# Altium schematic sheet as14120_adc.SchDoc
size A3; PageSetup: Record=PageOptions|CenterHorizontal=True|CenterVertical=True|PrintScale=1.11|XCorrection=1.00|YCorrection=1.00|PrintKind=0|BorderSize=5000000|LeftOffset=0|BottomOffset=0|Orientation=2|PaperLength=1000|PaperWidth=1000|Scale=100|PaperSource=7|PrintQuality=-4|MediaType=1|DitherType=10|PaperKind=A4 (210 x 297 мм)|PrintScaleMode=1
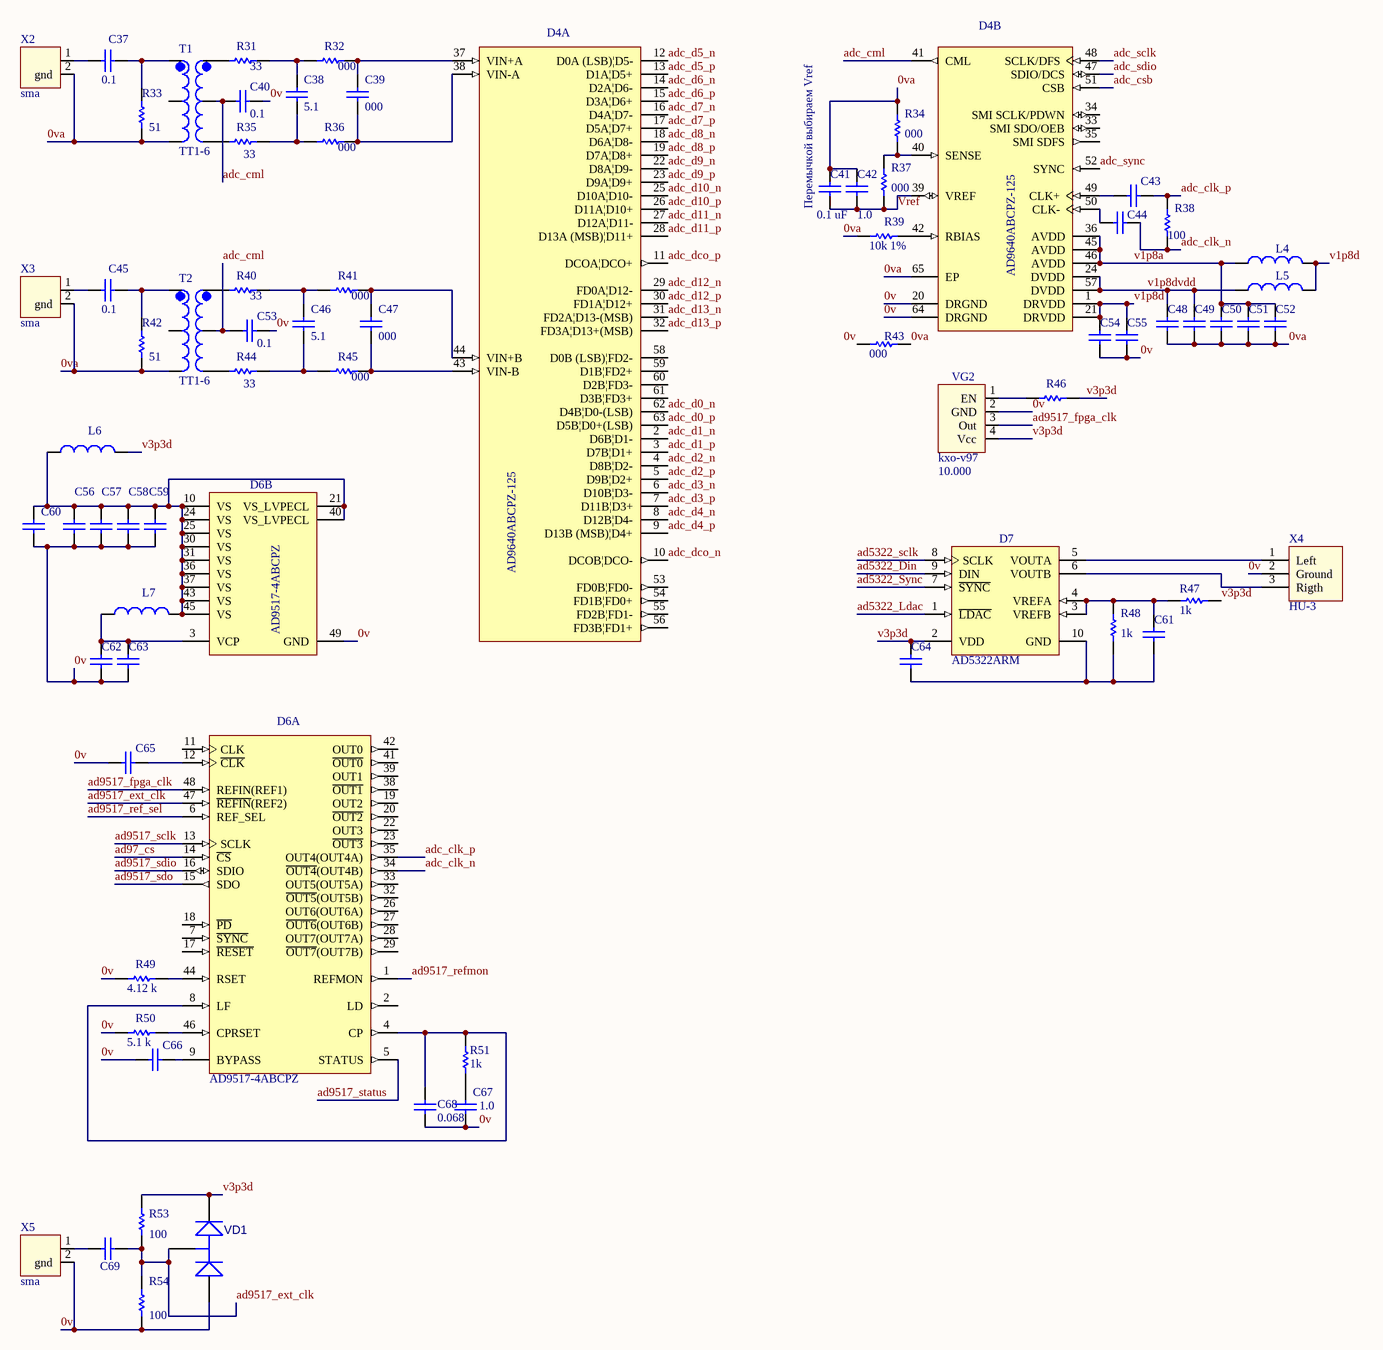
[diagram p0: as14120_adc.SchDoc]

## Parts
C37  value 0.1  [CAPC0402(1005)60_M]  (hidden comment: CAP 1uF 10V 0402(1005))
C38  value 5.1  [CAPC0805(2012)100_N]  (hidden comment: CAP_0805)
C39  value 000  [CAPC0805(2012)100_N]  (hidden comment: CAP_0805)
C40  value 0.1  [CAPC0402(1005)60_M]  (hidden comment: CAP 1uF 10V 0402(1005))
C41  value 0.1 uF  [CAPC0402(1005)60_M]  (hidden comment: CAP 1uF 10V 0402(1005))
C42  value 1.0  [CAPC0402(1005)60_M]  (hidden comment: CAP 1uF 10V 0402(1005))
C43  CAP 1uF 10V 0402(1005)  [CAPC0402(1005)60_M]  (value not drawn)
C44  CAP 1uF 10V 0402(1005)  [CAPC0402(1005)60_M]  (value not drawn)
C45  value 0.1  [CAPC0402(1005)60_M]  (hidden comment: CAP 1uF 10V 0402(1005))
C46  value 5.1  [CAPC0805(2012)100_N]  (hidden comment: CAP_0805)
C47  value 000  [CAPC0805(2012)100_N]  (hidden comment: CAP_0805)
C48  CAP 1uF 10V 0402(1005)  [CAPC0402(1005)60_M]  (value not drawn)
C49  CAP 1uF 10V 0402(1005)  [CAPC0402(1005)60_M]  (value not drawn)
C50  CAP 1uF 10V 0402(1005)  [CAPC0402(1005)60_M]  (value not drawn)
C51  CAP 1uF 10V 0402(1005)  [CAPC0402(1005)60_M]  (value not drawn)
C52  CAP 1uF 10V 0402(1005)  [CAPC0402(1005)60_M]  (value not drawn)
C53  value 0.1  [CAPC0402(1005)60_M]  (hidden comment: CAP 1uF 10V 0402(1005))
C54  CAP 1uF 10V 0402(1005)  [CAPC0402(1005)60_M]  (value not drawn)
C55  CAP 1uF 10V 0402(1005)  [CAPC0402(1005)60_M]  (value not drawn)
C56  CAP 1uF 10V 0402(1005)  [CAPC0402(1005)60_M]  (value not drawn)
C57  CAP 1uF 10V 0402(1005)  [CAPC0402(1005)60_M]  (value not drawn)
C58  CAP 1uF 10V 0402(1005)  [CAPC0402(1005)60_M]  (value not drawn)
C59  CAP 1uF 10V 0402(1005)  [CAPC0402(1005)60_M]  (value not drawn)
C60  CAP 1uF 10V 0402(1005)  [CAPC0402(1005)60_M]  (value not drawn)
C61  CAP 1uF 10V 0402(1005)  [CAPC0402(1005)60_M]  (value not drawn)
C62  CAP 1uF 10V 0402(1005)  [CAPC0402(1005)60_M]  (value not drawn)
C63  CAP 1uF 10V 0402(1005)  [CAPC0402(1005)60_M]  (value not drawn)
C64  CAP 1uF 10V 0402(1005)  [CAPC0402(1005)60_M]  (value not drawn)
C65  CAP 1uF 10V 0402(1005)  [CAPC0402(1005)60_M]  (value not drawn)
C66  CAP 1uF 10V 0402(1005)  [CAPC0402(1005)60_M]  (value not drawn)
C67  value 1.0  [CAPC0805(2012)100_N]  (hidden comment: CAP_0805)
C68  value 0.068  [CAPC0805(2012)100_N]  (hidden comment: CAP_0805)
C69  CAP 1uF 10V 0402(1005)  [CAPC0402(1005)60_M]  (value not drawn)
D4  AD9640ABCPZ-125  [CP-64-6_N]  (parts A,B of 2)
D6  AD9517-4ABCPZ  [ADI-CP-48-8_L]  (parts A,B of 2)
D7  AD5322ARM  [RM-10_L]
L4  BLM21PG300SN1D  [CAPC0805(2012)100_N]  (value not drawn)
L5  BLM21PG300SN1D  [CAPC0805(2012)100_N]  (value not drawn)
L6  BLM21PG300SN1D  [CAPC0805(2012)100_N]  (value not drawn)
L7  BLM21PG300SN1D  [CAPC0805(2012)100_N]  (value not drawn)
R31  value 33  [RESC0805(2012)_L]  (hidden comment: 1K 1% 0805(2012))
R32  value 000  [RESC0805(2012)_L]  (hidden comment: 1K 1% 0805(2012))
R33  value 51  [RESC0805(2012)_L]  (hidden comment: 1K 1% 0805(2012))
R34  value 000  [RESC0603(1608)_L]  (hidden comment: 1K 5% 0603(1608))
R35  value 33  [RESC0805(2012)_L]  (hidden comment: 1K 1% 0805(2012))
R36  value 000  [RESC0805(2012)_L]  (hidden comment: 1K 1% 0805(2012))
R37  value 000  [RESC0603(1608)_L]  (hidden comment: 1K 5% 0603(1608))
R38  100  [RESC0805(2012)_L]
R39  10k 1%  [RESC0805(2012)_L]
R40  value 33  [RESC0805(2012)_L]  (hidden comment: 1K 1% 0805(2012))
R41  value 000  [RESC0805(2012)_L]  (hidden comment: 1K 1% 0805(2012))
R42  value 51  [RESC0805(2012)_L]  (hidden comment: 1K 1% 0805(2012))
R43  000  [RESC0603(1608)_L]
R44  value 33  [RESC0805(2012)_L]  (hidden comment: 1K 1% 0805(2012))
R45  value 000  [RESC0805(2012)_L]  (hidden comment: 1K 1% 0805(2012))
R46  1K 5% 0603(1608)  [RESC0603(1608)_L]  (value not drawn)
R47  1k  [RESC0603(1608)_L]
R48  1k  [RESC0603(1608)_L]
R49  value 4.12 k  [RESC0805(2012)_L]  (hidden comment: 1K 1% 0805(2012))
R50  value 5.1 k  [RESC0805(2012)_L]  (hidden comment: 1K 1% 0805(2012))
R51  value 1k  [RESC0805(2012)_L]  (hidden comment: 1K 1% 0805(2012))
R53  value 100  [RESC0805(2012)_L]  (hidden comment: 1K 1% 0805(2012))
R54  value 100  [RESC0805(2012)_L]  (hidden comment: 1K 1% 0805(2012))
T1  TT1-6  [TT!-6-KK81]
T2  TT1-6  [TT!-6-KK81]
VD1  BAV99  [SO-G3/X.9]  (value not drawn)
VG2  kxo-v97  value 10.000  [kxo-v97]
X2  sma  [sma]
X3  sma  [sma]
X4  HU-3  [HU-3]
X5  sma  [sma]

## Nets
0v: C40.2 C53.2 C54.1 C55.1 C56.1 C57.1 C58.1 C59.1 C60.1 C62.1 C63.1 C65.1 C66.1 C67.1 C68.1 D4.20(DRGND) D4.64(DRGND) D6.49(GND) R49.2 R50.2 R54.1 VD1.3(A) VG2.2(GND) X4.2(Ground) X5.2(gnd)
0va: C41.2 C42.2 C48.1 C49.1 C50.1 C51.1 C52.1 D4.65(EP) R33.1 R34.1 R39.2 R42.1 R43.2 T1.6 T2.6 X2.2(gnd) X3.2(gnd)
ad97_cs: D6.14(~{CS})
ad5322_Din: D7.9(DIN)
ad5322_Ldac: D7.1(~{LDAC})
ad5322_sclk: D7.8(SCLK)
ad5322_Sync: D7.7(~{SYNC})
ad9517_ext_clk: C69.2 D6.47(~{REFIN}(REF2)) R53.1 R54.2 VD1.1(C)
ad9517_fpga_clk: D6.48(REFIN(REF1)) VG2.3(Out)
ad9517_ref_sel: D6.6(REF_SEL)
ad9517_refmon: D6.1(REFMON)
ad9517_sclk: D6.13(SCLK)
ad9517_sdio: D6.16(SDIO)
ad9517_sdo: D6.15(SDO)
ad9517_status: D6.5(STATUS)
adc_clk_n: C44.1 D6.34(~{OUT4}(OUT4B)) R38.1
adc_clk_p: C43.1 D6.35(OUT4(OUT4A)) R38.2
adc_cml: C40.1 C53.1 D4.41(CML) T1.2 T2.2
adc_csb: D4.51(CSB)
adc_d0_n: D4.62(D4B|D0-(LSB))
adc_d0_p: D4.63(D5B|D0+(LSB))
adc_d1_n: D4.2(D6B|D1-)
adc_d1_p: D4.3(D7B|D1+)
adc_d2_n: D4.4(D8B|D2-)
adc_d2_p: D4.5(D9B|D2+)
adc_d3_n: D4.6(D10B|D3-)
adc_d3_p: D4.7(D11B|D3+)
adc_d4_n: D4.8(D12B|D4-)
adc_d4_p: D4.9(D13B_(MSB)|D4+)
adc_d5_n: D4.12(D0A_(LSB)|D5-)
adc_d5_p: D4.13(D1A|D5+)
adc_d6_n: D4.14(D2A|D6-)
adc_d6_p: D4.15(D3A|D6+)
adc_d7_n: D4.16(D4A|D7-)
adc_d7_p: D4.17(D5A|D7+)
adc_d8_n: D4.18(D6A|D8-)
adc_d8_p: D4.19(D7A|D8+)
adc_d9_n: D4.22(D8A|D9-)
adc_d9_p: D4.23(D9A|D9+)
adc_d10_n: D4.25(D10A|D10-)
adc_d10_p: D4.26(D11A|D10+)
adc_d11_n: D4.27(D12A|D11-)
adc_d11_p: D4.28(D13A_(MSB)|D11+)
adc_d12_n: D4.29(FD0A|D12-)
adc_d12_p: D4.30(FD1A|D12+)
adc_d13_n: D4.31(FD2A|D13-(MSB))
adc_d13_p: D4.32(FD3A|D13+(MSB))
adc_dco_n: D4.10(DCOB|DCO-)
adc_dco_p: D4.11(DCOA|DCO+)
adc_sclk: D4.48(SCLK/DFS)
adc_sdio: D4.47(SDIO/DCS)
adc_sync: D4.52(SYNC)
v1p8a: C50.2 C51.2 C52.2 D4.36(AVDD) D4.45(AVDD) D4.46(AVDD) L4.1
v1p8d: C54.2 C55.2 D4.1(DRVDD) D4.21(DRVDD) L4.2 L5.2
v1p8dvdd: C48.2 C49.2 D4.24(DVDD) D4.57(DVDD) L5.1
v3p3d: C64.2 D7.2(VDD) L6.2 R46.1 R47.2 R53.2 VD1.2(K) VG2.4(Vcc)
Vref: C41.1 C42.1 D4.39(VREF) R37.2
NetC37_1: C37.1 X2.1
NetC37_2: C37.2 R33.2 T1.4
NetC38_1: C38.1 R35.1 R36.2
NetC38_2: C38.2 R31.1 R32.2
NetC39_1: C39.1 D4.38(VIN-A) R36.1
NetC39_2: C39.2 D4.37(VIN+A) R32.1
NetC43_2: C43.2 D4.49(CLK+)
NetC44_2: C44.2 D4.50(CLK-)
NetC45_1: C45.1 X3.1
NetC45_2: C45.2 R42.2 T2.4
NetC46_1: C46.1 R44.1 R45.2
NetC46_2: C46.2 R40.1 R41.2
NetC47_1: C47.1 D4.43(VIN-B) R45.1
NetC47_2: C47.2 D4.44(VIN+B) R41.1
NetC56_2: C56.2 C57.2 C58.2 C59.2 C60.2 D6.10(VS) D6.21(VS_LVPECL) D6.24(VS) D6.25(VS) D6.30(VS) D6.31(VS) D6.36(VS) D6.37(VS) D6.40(VS_LVPECL) D6.43(VS) D6.45(VS) L6.1 L7.2
NetC61_1: C61.1 C64.1 D7.10(GND) R48.2
NetC61_2: C61.2 D7.3(VREFB) D7.4(VREFA) R47.1 R48.1
NetC62_2: C62.2 C63.2 D6.3(VCP) L7.1
NetC65_2: C65.2 D6.12(~{CLK})
NetC66_2: C66.2 D6.9(BYPASS)
NetC67_2: C67.2 R51.2
NetC68_2: C68.2 D6.4(CP) D6.8(LF) R51.1
NetC69_1: C69.1 X5.1
NetD4_40: D4.40(SENSE) R34.2 R37.1
NetD4_42: D4.42(RBIAS) R39.1
NetD6_44: D6.44(RSET) R49.1
NetD6_46: D6.46(CPRSET) R50.1
NetD7_5: D7.5(VOUTA) X4.1(Left)
NetD7_6: D7.6(VOUTB) X4.3(Rigth)
NetR31_2: R31.2 T1.3
NetR35_2: R35.2 T1.1
NetR40_2: R40.2 T2.3
NetR44_2: R44.2 T2.1
NetR46_2: R46.2 VG2.1(EN)

Not connected (* = marked no-connect by the designer): D4 33(SMI_SDO/OEB) 34(SMI_SCLK/PDWN) 35(SMI_SDFS) 53(FD0B|FD0-) 54(FD1B|FD0+) 55(FD2B|FD1-) 56(FD3B|FD1+) 58(D0B_(LSB)|FD2-) 59(D1B|FD2+) 60(D2B|FD3-) 61(D3B|FD3+); D6 2(LD) 7(~{SYNC}) 11(CLK) 17(~{RESET}) 18(~{PD}) 19(OUT2) 20(~{OUT2}) 22(OUT3) 23(~{OUT3}) 26(OUT6(OUT6A)) 27(~{OUT6}(OUT6B)) 28(OUT7(OUT7A)) 29(~{OUT7}(OUT7B)) 32(~{OUT5}(OUT5B)) 33(OUT5(OUT5A)) 38(~{OUT1}) 39(OUT1) 41(~{OUT0}) 42(OUT0); R43 1; T1 5; T2 5

## Notes on the sheet
- (near C41) Перемычкой выбираем Vref
- Labels drawn without touching a wire or pin: 0v
- Title
- Size:
- Date:
- A3
- Number:
- Time:
- Revision:
- Sheet
- of
- File:

## Library data of the parts
C37 C40-C42 C45 C53 = CAP_0402: CAP 1uF 10V ±20% 0402 (1005 Metric) Thickness 0.6mm SMD; Case-Metric: 1005; Case-EIA: 0402; Tolerance: ±20%; Max Thickness: 0.6 mm; Rated Voltage: 10 V; Technology: SMT
C43 C44 C48-C52 C54-C66 = CAP_0402: CAP 1uF 10V ±20% 0402 (1005 Metric) Thickness 0.6mm SMD; Case-Metric: 1005; Case-EIA: 0402; Value: 0.1 uF; Tolerance: ±20%; Max Thickness: 0.6 mm; Rated Voltage: 10 V; Technology: SMT
C69 = CAP_0402: CAP 1uF 10V ±20% 0402 (1005 Metric) Thickness 0.6mm SMD; Case-Metric: 1005; Case-EIA: 0402; Value: 0.01 uF; Tolerance: ±20%; Max Thickness: 0.6 mm; Rated Voltage: 10 V; Technology: SMT
D4 = AD9640ABCPZ-125: Dual 14-Bit Analog-to-Digital Converter with Parallel Interface, 1.8 V, 125MSPS, -40 to +85 degC, CP-64-6, Pb-Free, Tray; Part Number: AD9640-125; Manufacturer: Analog Devices; Resolution (Bits): 14; Channels: 2; Throughput Rate (SPS): 125M; Interface: Par; DatasheetVersion: Rev.B; PackageVersion: 041509-A; PackageReference: CP-64-6; PackageDescription: 64-Lead Lead Frame Chip Scale Package [LFCSP_VQ] 9 x 9 mm Body, Very Thin Quad; RoHS: Y; Packing: Tray; Mounting Technology: Surface Mount; Code_JEDEC: MO-220-VMMD-4; ComponentLink1Description: Manufacturer URL; ComponentLink1URL: http://www.analog.com/en/index.html; ComponentLink2Description: Datasheet; ComponentLink2URL: http://www.analog.com/static/imported-files/data_sheets/AD9640.pdf; ComponentLink3Description: Package Specification; ComponentLink3URL: http://www.analog.com/static/imported-files/packages/PKG_PDF/LFCSP(CP)/CP_64_6.pdf; ComponentLink4Description: Product URL; ComponentLink4URL: http://www.analog.com/en/analog-to-digital-converters/ad-converters/ad9640/products/product.html
D6 = AD9517-4ABCPZ: 12-Output Clock Generator with Integrated 2.5 GHz VCO, 1800 MHz Max f-out, CP-48-8, Pb-Free, 260 Tray; Product Description: Multi-Output Clock Generator; +Supply Voltage (V): 3.3; Inputs: 2; Outputs: 12; Dividers: 4; On-Chip VCO or DCO: Yes; Max f-out (MHz): 1800; Output Logic: CMOS; LVDS; LVPECL; DatasheetVersion: Rev.D; PackageVersion: 02-23-2010-C; PackageReference: CP-48-8; PackageDescription: 48-Lead Lead Frame Chip Scale Package [LFCSP_VQ]; Code_JEDEC: MO-220-VKKD-2; ComponentLink1Description: Manufacturer URL; ComponentLink1URL: www.analog.com; ComponentLink2Description: Datasheet; ComponentLink2URL: http://www.analog.com/static/imported-files/data_sheets/AD9517-4.pdf; ComponentLink3Description: Package Specification; ComponentLink3URL: http://www.analog.com/static/imported-files/packages/PKG_PDF/LFCSP(CP)/CP_48_8.pdf
D7 = AD5322ARM: Dual 12-Bit Rail-to-Rail Output Digital-to-Analog Converter, 2.5 to 5.5 V, -40 to +105 degC, RM-10, Tube; ADI Part Number: AD5322; Manufacturer: Analog Devices; # DAC Outputs: 2; Max V+: 5.5V; Op Pwr Diss: 2.5mW; Resolution (Bits): 12; Settling Time: 8µs; Single Supply: Yes; DatasheetVersion: Rev.D; PackageVersion: May-2005; PackageReference: RM-10; PackageDescription: 10-Lead Mini Small Outline Package [MSOP]; Packing: Tube; RoHS: N; Mounting Technology: Surface Mount; ComponentLink1Description: Manufacturer URL; ComponentLink1URL: http://www.analog.com/en/index.html; ComponentLink2Description: Datasheet; ComponentLink2URL: http://www.analog.com/static/imported-files/data_sheets/AD5302_5312_5322.pdf; ComponentLink3Description: Package Specification; ComponentLink3URL: http://www.analog.com/static/imported-files/packages/PKG_PDF/MSOP%28RM%29/RM_10.pdf; ComponentLink4Description: URL Link1; ComponentLink4URL: Product URL:http://www.analog.com/en/digital-to-analog-converters/da-converters/ad5322/products/product.html
L4-L7 = Ferrite_beat
R31-R33 R35 R36 R38-R42 R44 R45 R49-R51 R53 R54 = RES_0805: 1K 0.125W 1% 0805 (2012 Metric)  SMD; Case-Metric: 2012; Case-EIA: 0805; Tolerance: 1 %; Power: 0.125 W; Technology: SMT
  R38: Value: 100
  R39: Value: 10k 1%
R34 R37 R43 R47 R48 = RES_0603: 1K 0.1W 5% 0603 (1608 Metric)  SMD; Case-Metric: 1608; Case-EIA: 0603; Tolerance: 5 %; Power: 0.1 W; Technology: SMT
  R43: Value: 000
  R47 R48: Value: 1k
R46 = RES_0603: 1K 0.1W 5% 0603 (1608 Metric)  SMD; Case-EIA: 0603; Case-Metric: 1608; Value: 1000.00 Ohm; Technology: SMT; Tolerance: 5 %; Power: 0.1 W
T1 T2 = TT1-6-KK81
VD1 = BAV99: SOT23 Silicon Planar High-Speed Switching Series Diode Pair; Value: {Value}; OriginalName: BAV99